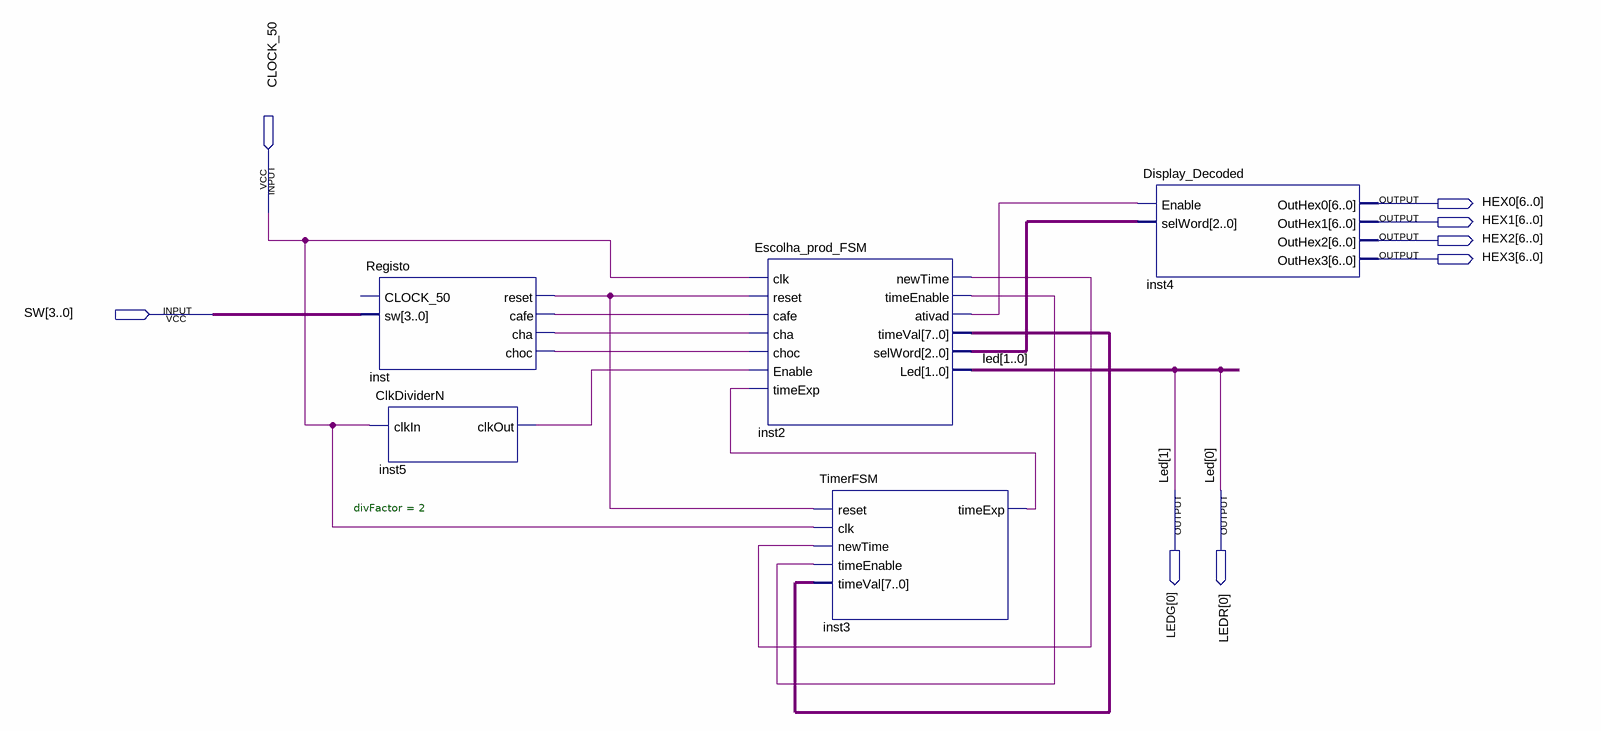
[diagram p0: schematic sheet]
// Quartus schematic Maquina_Auto_ofe_proDemo.bdf as structural Verilog: 5 symbols, 8 pins
module Maquina_Auto_ofe_proDemo (
  input  CLOCK_50,
  input  [3:0] SW,
  output [6:0] HEX0,
  output [6:0] HEX1,
  output [6:0] HEX2,
  output [6:0] HEX3,
  output [0:0] LEDG,
  output [0:0] LEDR
);

  wire inst2_ativad, inst2_newtime, inst2_timeenable, inst3_timeexp, inst5_clkout, inst_cafe, inst_cha,
       inst_choc, inst_reset;
  wire [2:0] inst2_selword;
  wire [7:0] inst2_timeval;

  Registo inst (.sw(SW), .reset(inst_reset), .cafe(inst_cafe), .cha(inst_cha), .choc(inst_choc));  // open: CLOCK_50
  ClkDividerN #(.divFactor(2)) inst5 (.clkIn(CLOCK_50), .clkOut(inst5_clkout));
  Escolha_prod_FSM inst2 (
    .clk(CLOCK_50), .reset(inst_reset), .cafe(inst_cafe), .cha(inst_cha), .choc(inst_choc),
    .Enable(inst5_clkout), .timeExp(inst3_timeexp), .newTime(inst2_newtime), .timeEnable(inst2_timeenable),
    .ativad(inst2_ativad), .timeVal(inst2_timeval), .selWord(inst2_selword), .Led({LEDG[0], LEDR[0]}));
  TimerFSM inst3 (
    .reset(inst_reset), .clk(CLOCK_50), .newTime(inst2_newtime), .timeEnable(inst2_timeenable),
    .timeVal(inst2_timeval), .timeExp(inst3_timeexp));
  Display_Decoded inst4 (
    .Enable(inst2_ativad), .selWord(inst2_selword), .OutHex0(HEX0), .OutHex1(HEX1), .OutHex2(HEX2),
    .OutHex3(HEX3));

  // Other names for the same wires on the sheet: Led[1:0] = {LEDG[0], LEDR[0]}
endmodule
